# EAGLE design KEYWAVE STARTER (EAGLE 6.5.0)
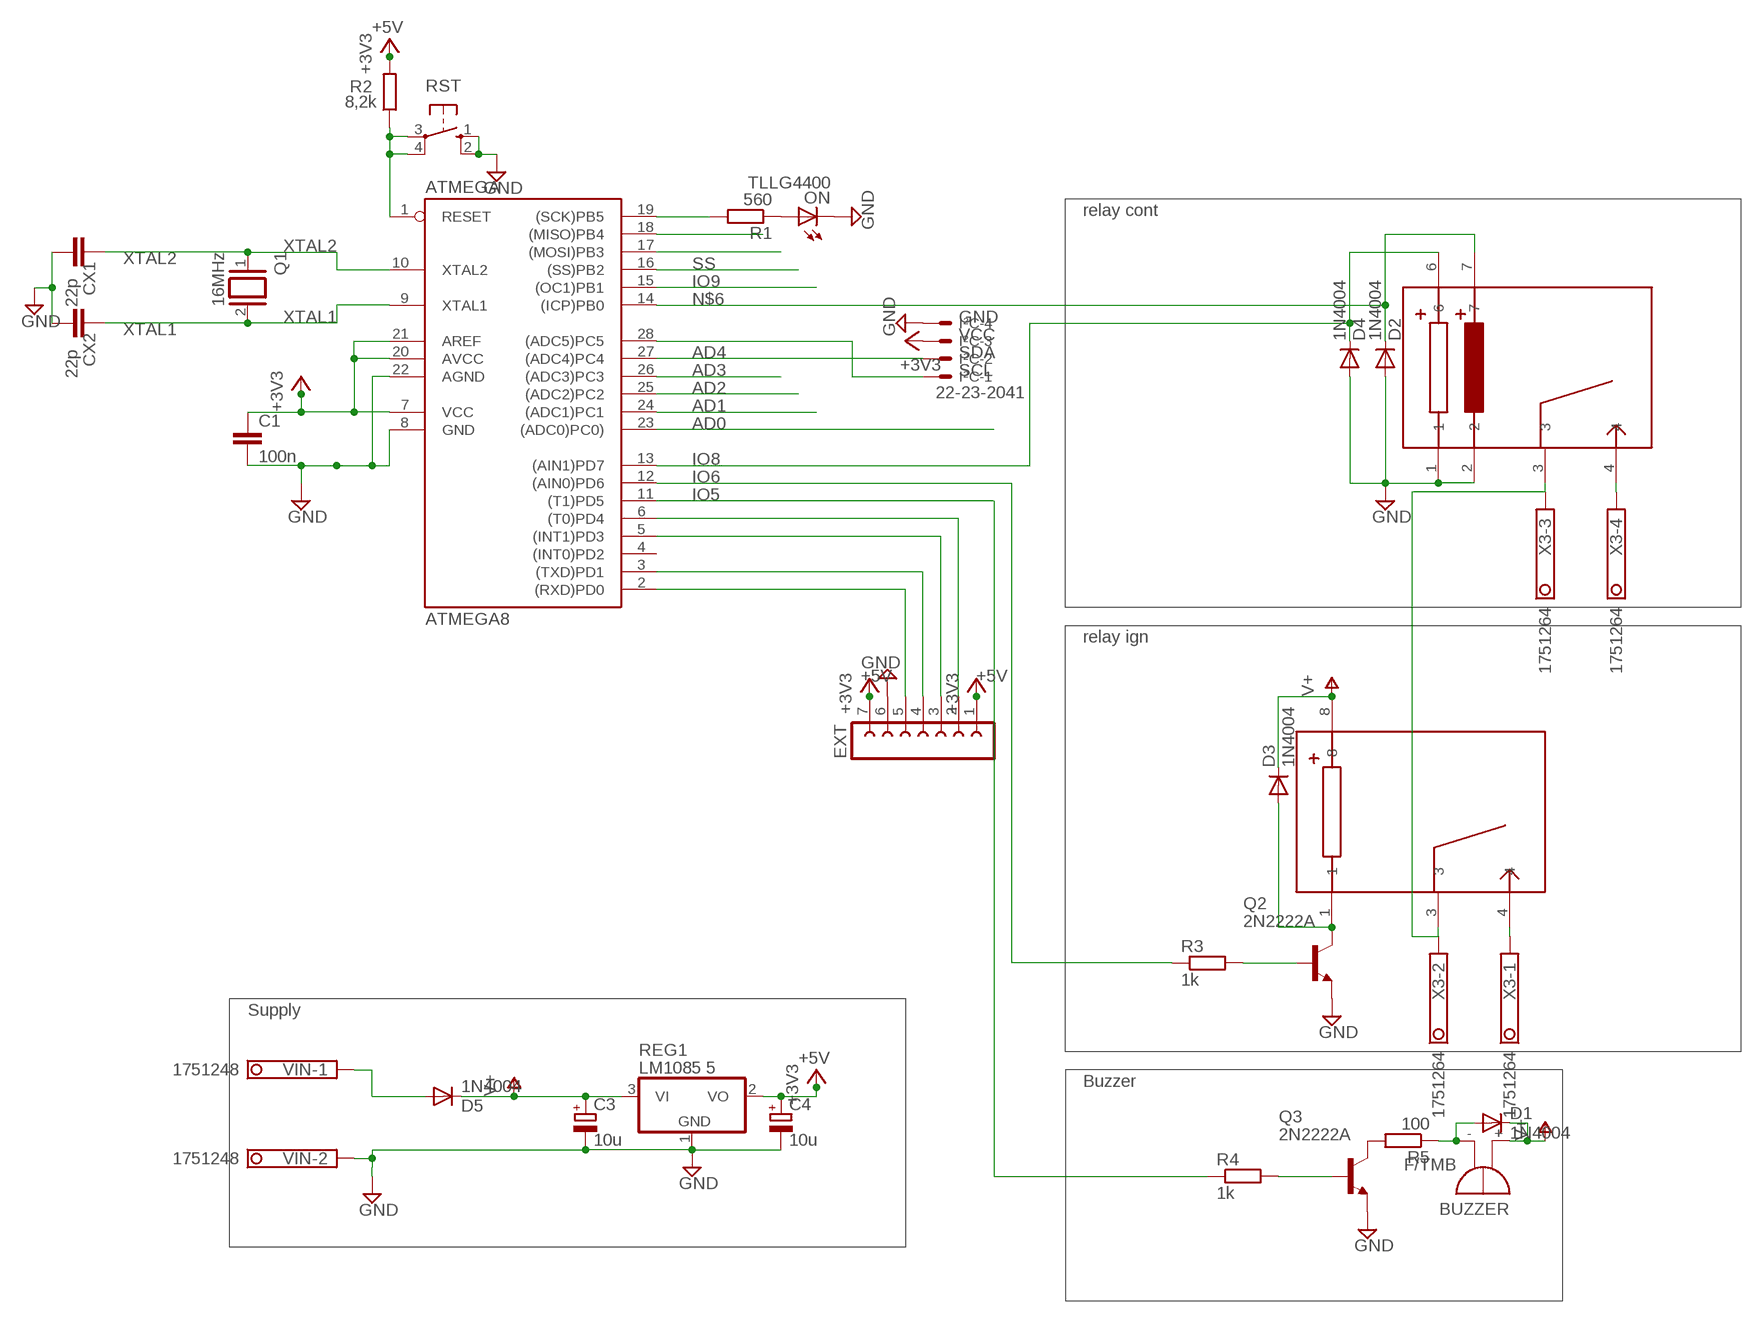
[diagram p0: schematic, sheet 1]

## Parts
ATMEGA  ATMEGA8  AT90S4433P  [DIL28-3]
BUZZER  F/TMB  [F/TMB]
C1  100n  C-EU050-030X075  [C050-030X075]
C3  10u  CPOL-EUE5-6  [E5-6]
C4  10u  CPOL-EUE5-6  [E5-6]
CONTACT  D6BK-1114P  [D6BK-1114C]
CX1  22p  C-EU0603-RND  [C0603-ROUND]
CX2  22p  C-EU0603-RND  [C0603-ROUND]
D1  1N4004  [DO41-10]
D2  1N4004  [DO41-10]
D3  1N4004  [DO41-10]
D4  1N4004  [DO41-10]
D5  1N4004  [DO41-10]
EXT  FE07-1  [FE07]
I²C  22-23-2041  [22-23-2041]
ON  TLLG4400  [LED3MM]
Q1  16MHz  XTAL/S  [QS]
Q2  2N2222A  [TO18]
Q3  2N2222A  [TO18]
R1  560  R-EU_0207/10  [0207/10]
R2  8,2k  R-EU_0207/10  [0207/10]
R3  1k  R-EU_0207/10  [0207/10]
R4  1k  R-EU_0207/10  [0207/10]
R5  100  R-EU_0207/10  [0207/10]
REG1  LM1085 5  LM1086CT-3.3  [TO220]
RST  10-XX  [B3F-10XX]
STARTER  DK1-L1-12V  [DK1-L1-12V]
VIN  1751248  [1751248]
X3  1751264  [1751264]

## Nets
+3V3: ATMEGA.7(VCC) ATMEGA.20(AVCC) ATMEGA.21(AREF) C1.1 C4.+ EXT.1 EXT.7 I²C.3 R2.2 REG1.2(VO) ; supply symbol labelled +5V
AD0: ATMEGA.23((ADC0)PC0))
AD1: ATMEGA.24((ADC1)PC1)
AD2: ATMEGA.25((ADC2)PC2)
AD3: ATMEGA.26((ADC3)PC3)
AD4: ATMEGA.27((ADC4)PC4) I²C.2
GND: ATMEGA.8(GND) ATMEGA.22(AGND) C1.2 C3.- C4.- CONTACT.1 CONTACT.2 CX1.1 CX2.1 D2.A D4.A EXT.6 I²C.4 ON.K(C) Q2.1(E) Q3.1(E) REG1.1(GND) RST.1(S) RST.2(S1) VIN.2
IO5: ATMEGA.11((T1)PD5) R4.1
IO6: ATMEGA.12((AIN0)PD6) R3.1
IO8: ATMEGA.13((AIN1)PD7) CONTACT.6 D4.C
IO9: ATMEGA.15((OC1)PB1)
MISO: ATMEGA.18((MISO)PB4)
MOSI: ATMEGA.17((MOSI)PB3)
N$1: STARTER.4 X3.1
N$2: Q3.3(C) R5.2
N$3: D5.A VIN.1
N$5: Q2.2(B) R3.2
N$6: ATMEGA.14((ICP)PB0) CONTACT.7 D2.C
N$8: CONTACT.3 STARTER.3 X3.2 X3.3
N$9: ATMEGA.28((ADC5)PC5) I²C.1
N$10: CONTACT.4 X3.4
N$11: ATMEGA.2((RXD)PD0) EXT.5
N$12: ATMEGA.3((TXD)PD1) EXT.4
N$13: ATMEGA.5((INT1)PD3) EXT.3
N$14: ATMEGA.6((T0)PD4) EXT.2
N$16: Q3.2(B) R4.2
N$17: D3.A Q2.3(C) STARTER.1
N$19: BUZZER.- D1.A R5.1
N$22: ON.A R1.1
RESET: ATMEGA.1(RESET) R2.1 RST.3(P) RST.4(P1)
SCK: ATMEGA.19((SCK)PB5) R1.2
SS: ATMEGA.16((SS)PB2)
V+: BUZZER.+ C3.+ D1.C D3.C D5.C REG1.3(VI) STARTER.8
XTAL1: ATMEGA.9(XTAL1) CX2.2 Q1.2
XTAL2: ATMEGA.10(XTAL2) CX1.2 Q1.1
Unconnected: ATMEGA.4((INT0)PD2)

## Notes on the sheet
- relay cont
- GND
- VCC
- SDA
- SCL
- relay ign
- Supply
- Buzzer

## Library data of the parts
ATMEGA = atmel:AT90S4433: MICROCONTROLLER 4 Kbytes FLASH 128 bytes SRAM 256 bytes EEPROM UART 6-channel 10 bit ADC
BUZZER = buzzer:F/TMB: BUZZER Source: Buerklin; OC_FARNELL: unknown; OC_NEWARK: unknown
C1 = rcl:C-EU: CAPACITOR, European symbol
C3 C4 = rcl:CPOL-EU: POLARIZED CAPACITOR, European symbol
CONTACT = stein:D6BK-1114P
CX1 CX2 = SmartPrj:C-EU: CAPACITOR, European symbol
D1-D5 = diode:1N4004: DIODE general purpose rectifier, 1 A
EXT = con-lsta:FE07-1: FEMALE HEADER; OC_FARNELL: unknown; OC_NEWARK: unknown
I²C = con-molex:22-23-2041: .100" (2.54mm) Center Header - 4 Pin; MF: MOLEX; MPN: 22-23-2041; OC_FARNELL: 1462920; OC_NEWARK: 38C0355
ON = led:TLLG4400: Low Current (2mA) LED 3 mm Tinted Diffused Package color GREEN Source: Data sheet <http://www.farnell.com/datasheets/391098.pdf>; MF: VISHAY SEMICONDUCTOR; OC_FARNELL: 1612435
Q1 = special:XTAL/S: CRYSTAL
Q2 Q3 = transistor-npn:2N2222*: NPN Transistor
R1-R5 = rcl:R-EU_: RESISTOR, European symbol
REG1 = natsemi:LM1086?-*: Positive VOLTAGE REGULATOR From National Semiconductors LM1086 datasheet <http://www.national.com/ds/LM/LM1086.pdf>
RST = switch-omron:10-XX: OMRON SWITCH; MPN: B3F-1000; OC_FARNELL: 176432; OC_NEWARK: 36M3542
STARTER = stein:DK1-L1-12V
VIN = con-phoenix-350:1751248: MKDS 1/ 2-3,5 Printklemme Nennstrom: 10 A Bemessungsspannung: 160 V Raster: 3,5 mm Polzahl: 2 Montageart: Löten Anschlussart: Schraubanschluss Anschlussrichtung vom Leiter zur Platine: 0° Source: http://eshop.phoenixcontact.com .. 1751248.pdf; OC_FARNELL: unknown; OC_NEWARK: unknown
X3 = con-phoenix-350:1751264: MKDS 1/ 4-3,5 Printklemme Nennstrom: 10 A Bemessungsspannung: 160 V Raster: 3,5 mm Polzahl: 4 Montageart: Löten Anschlussart: Schraubanschluss Anschlussrichtung vom Leiter zur Platine: 0° Source: http://eshop.phoenixcontact.com .. 1751264.pdf; MPN: 1751264; OC_FARNELL: unknown; OC_NEWARK: 10R0934

## Net classes
1 power: width 0.6 mm, clearance 0.305 mm

## Board
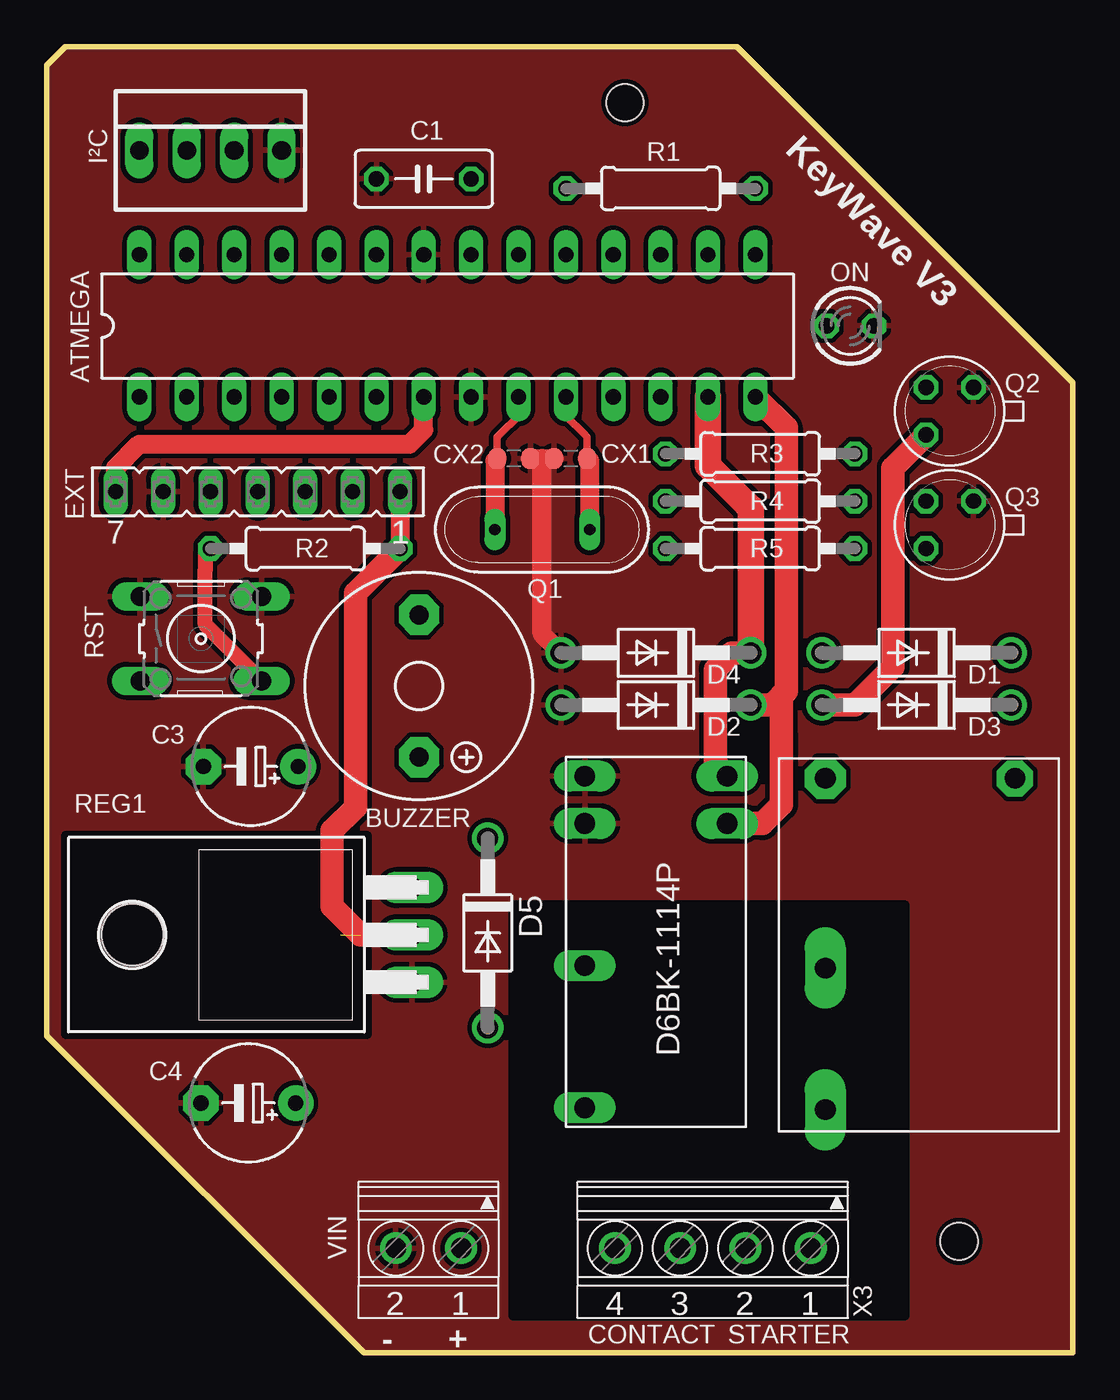
[diagram p1: board, top side]
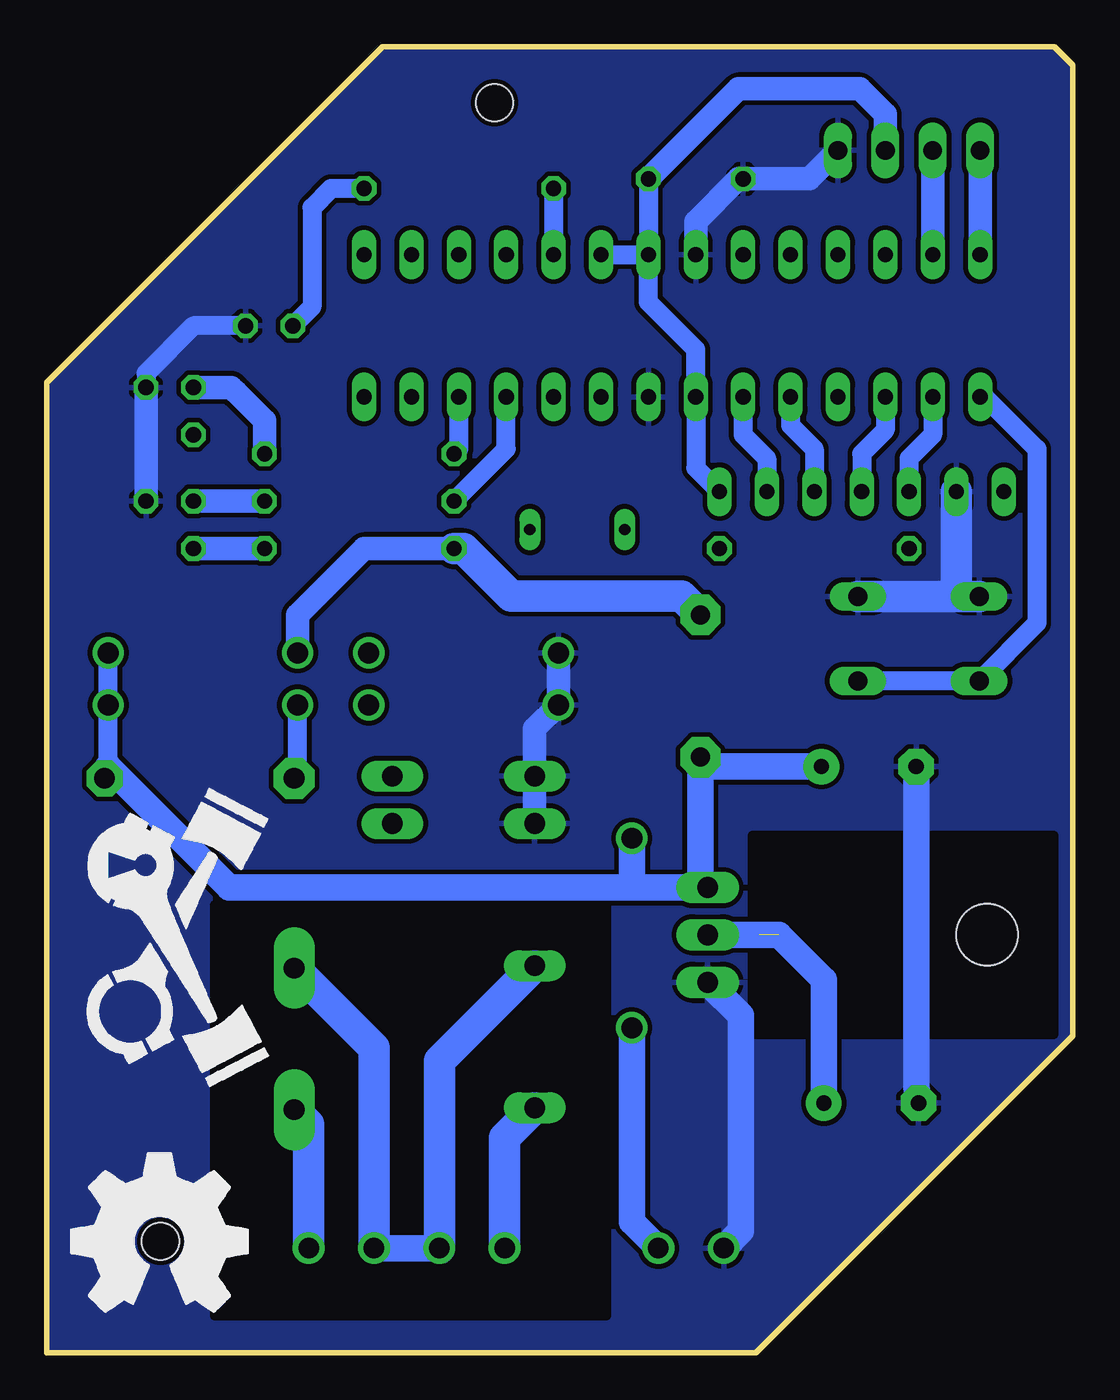
[diagram p2: board, bottom side, seen from below]

Size 55 x 70 mm. Coordinates in mm from the lower left corner, seen from the top.
Outline: 17,0 55,0 55,52 37,70 1,70 0,69 0,17 17,0
Copper layers (1*16): Top 0.035mm / dielectric 1.5mm / Bottom 0.035mm
Design rules "default": minimum track width 10mil, minimum drill 24mil, track to track 8mil, track to pad 8mil, pad to pad 8mil, via to via 8mil, smd to smd 8mil, copper to edge 0mil, drill to drill 8mil, minimum pad ring 10mil, minimum via ring 8mil, stop-mask expansion 4mil, vias tented up to drill 0mil, thermal gap 10mil
Holes 2 mm at 48.9,5.97 31,67
tRestrict: area 25,2 to 46,24
bRestrict: area 25,2 to 46,24

### Footprints (pad centres in the part's own frame; a part is rotated, then mirrored left to right if it is on the bottom)
DIL28-3 = drill 0.813 long: 1 -16.51,-3.81; 2 -13.97,-3.81; 3 -11.43,-3.81; 4 -8.89,-3.81; 5 -6.35,-3.81; 6 -3.81,-3.81; 7 -1.27,-3.81; 8 1.27,-3.81; 9 3.81,-3.81; 10 6.35,-3.81; 11 8.89,-3.81; 12 11.43,-3.81; 13 13.97,-3.81; 14 16.51,-3.81; 15 16.51,3.81; 16 13.97,3.81; 17 11.43,3.81; 18 8.89,3.81; 19 6.35,3.81; 20 3.81,3.81; 21 1.27,3.81; 22 -1.27,3.81; 23 -3.81,3.81; 24 -6.35,3.81; 25 -8.89,3.81; 26 -11.43,3.81; 27 -13.97,3.81; 28 -16.51,3.81
F/TMB = drill 1.016 pad 2.159 octagon: + 3.81,0; - -3.81,0
C050-030X075 = drill 0.813 octagon: 1 -2.54,0; 2 2.54,0
E5-6 = drill 0.813 pad 1.905: + -2.54,0 | drill 0.813 pad 1.905 octagon: - 2.54,0
D6BK-1114C = drill 1.1 long: 1 0,0; 2 2.54,0; 3 10.16,0; 4 17.78,0; 6 0,7.62; 7 2.54,7.62
C0603-ROUND = smd 0.898 x 1.1: 1 -0.889,0; 2 0.889,0
DO41-10 = drill 1.118: A 5.08,0; C -5.08,0
FE07 = drill 0.813 long: 1 -7.62,0; 2 -5.08,0; 3 -2.54,0; 4 0,0; 5 2.54,0; 6 5.08,0; 7 7.62,0
22-23-2041 = drill 1 long: 1 -3.81,0; 2 -1.27,0; 3 1.27,0; 4 3.81,0
LED3MM = drill 0.813 octagon: A -1.27,0; K 1.27,0
QS = drill 0.61 long: 1 -2.54,0; 2 2.54,0
TO18 = drill 0.813 octagon: 1 -1.27,-1.27; 2 1.27,-1.27; 3 1.27,1.27
0207/10 = drill 0.813 octagon: 1 -5.08,0; 2 5.08,0
TO220 = drill 1.118 long: 1 -2.54,-6.35; 2 0,-6.35; 3 2.54,-6.35 | hole 3.302: 0,8.636
B3F-10XX = drill 1.016 long: 1 -3.251,2.261; 2 3.251,2.261; 3 -3.251,-2.261; 4 3.251,-2.261
DK1-L1-12V = drill 1.1 pad 2.184 octagon: 1 7.495,3.62 | drill 1.1 pad 2.184 long: 3 -2.665,3.62; 4 -10.265,3.62 | drill 1.1 pad 1.93 octagon: 8 7.495,-6.54
1751248 = drill 1.1 pad 1.7: 1 -1.75,-0.1; 2 1.75,-0.1
1751264 = drill 1.1 pad 1.7: 1 -5.25,-0.1; 2 -1.75,-0.1; 3 1.75,-0.1; 4 5.25,-0.1

### Placement (x,y rotation side)
ATMEGA  21.48,55.04 0 top
BUZZER  19.96,35.74 270 top
C1  20.21,62.91 180 top
C3  10.94,31.42 180 top
C4  10.81,13.38 180 top
CONTACT  28.85,30.91 270 top
CX1  28.08,47.93 0 top
CX2  25.04,47.93 180 top
D1  46.63,37.51 180 top
D2  32.66,34.72 180 top
D3  46.63,34.72 180 top
D4  32.66,37.51 180 top
D5  23.64,22.5 270 top
EXT  11.32,46.15 180 top
I²C  8.78,64.44 0 top
ON  43.07,55.04 0 top
Q1  26.56,44.12 180 top
Q2  48.4,50.47 180 top
Q3  48.4,44.37 180 top
R1  32.91,62.4 180 top
R2  13.86,43.1 0 top
R3  38.24,48.18 0 top
R4  38.24,45.64 0 top
R5  38.24,43.1 0 top
REG1  13.23,22.4 90 top
RST  8.27,38.28 0 top
STARTER  45.36,23.29 90 top
VIN  20.46,5.51 180 top
X3  35.7,5.51 180 top

### Tracks (layer width: path | path; a pad name or v marks a point on that pad's centre or on a via)
+3V3  (1 unrouted)
  Top 1.016: EXT.7 3.7,47.42 4.97,48.69 19.45,48.69 20.21,49.45 ATMEGA.7 | EXT.1 R2.2
  Top 1.27: 16.83,22.4 15.31,23.92 15.31,27.99 16.55,29.23 16.55,40.71 R2.2
  Bottom 1.016: ATMEGA.21 22.75,56.31 20.21,53.77 ATMEGA.7 20.21,47.42 EXT.1 | ATMEGA.20 ATMEGA.21 | C1.1 ATMEGA.21
  Bottom 1.27: I²C.3 10.05,66.37 11.42,67.74 17.92,67.74 C1.1
  Bottom 1.422: C4.+ 13.35,19.99 15.77,22.4 REG1.2
AD4
  Bottom 1.27: I²C.2 ATMEGA.27
GND
  Top 1.016: D4.A 26.56,38.53 26.56,47.93 | 26.56,47.93 CX1.1 | CX2.1 26.56,47.93
  Bottom 1.016: ON.K 47.13,55.04 49.67,52.5 Q2.1
  Bottom 1.27: Q2.1 Q3.1 | CONTACT.2 CONTACT.1 28.85,33.45 D2.A D4.A | I²C.4 14.11,62.91 C1.2 17.92,62.91 20.21,60.63 ATMEGA.22
  Bottom 1.422: VIN.2 17.8,6.53 17.8,18.08 REG1.1 | C4.- 8.4,14.27 C3.-
  Bottom 1.676: RST.1 6.24,40.54 | 6.24,40.54 RST.2 | EXT.6 6.24,40.54
  pour Bottom (isolate 0.254): 0,69 1,70 37,70 55,52 55,0 17,0 0,17
  pour Top (isolate 0.254): 0,69 1,70 37,70 55,52 55,0 17,0 0,17
IO5
  Bottom 1.016: R4.1 30.37,48.44 ATMEGA.11
IO6
  Bottom 1.016: R3.1 32.91,48.44 ATMEGA.12
IO8
  Top 1.27: D4.C 36.72,37.51 35.83,36.62 35.83,31.55 CONTACT.6
  Top 1.422: ATMEGA.13 35.45,47.55 37.5,45.5 37.74,45.26 D4.C
N$1
  Bottom 1.676: STARTER.4 40.95,12.24 X3.1
N$2
  Bottom 1.27: R5.2 Q3.3
N$3
  Bottom 1.422: D5.A 23.64,7.04 VIN.1
N$5
  Bottom 1.27: R3.2 43.32,49.96 44.85,51.48 45.1,51.74 Q2.2
N$6
  Top 1.27: ATMEGA.14 39.64,49.58 39.64,36.37 39.64,35.48 39.32,35.16 | CONTACT.7 38.37,28.37 39.39,29.39 39.39,30.27 39.39,33.07 39.39,35.1 39.32,35.16 | D2.C 38.88,34.72 39.32,35.16
N$8
  Bottom 1.422: X3.2 X3.3
  Bottom 1.676: CONTACT.3 33.95,15.64 X3.3 | STARTER.3 37.45,16.34 X3.2
N$9
  Bottom 1.27: I²C.1 ATMEGA.28
N$10
  Bottom 1.676: CONTACT.4 30.45,11.52 X3.4
N$11
  Bottom 1.016: ATMEGA.2 7.51,49.2 8.78,47.93 EXT.5
N$12
  Bottom 1.016: ATMEGA.3 10.05,49.45 11.07,48.44 11.32,48.18 EXT.4
N$13
  Bottom 1.016: ATMEGA.5 15.13,49.71 13.86,48.44 EXT.3
N$14
  Bottom 1.016: ATMEGA.6 17.67,49.2 16.4,47.93 EXT.2
N$16
  Bottom 1.27: R4.2 Q3.2
N$17
  Top 1.27: Q2.3 45.36,47.42 45.36,39.55 45.36,36.75 43.32,34.72 D3.A
  Bottom 1.016: STARTER.1 41.55,30.98 D3.A
N$19
  Bottom 1.27: R5.1 37.99,43.1 41.55,39.55 D1.A
  Bottom 1.676: BUZZER.- 20.97,40.56 30.12,40.56 32.66,43.1 R5.1
N$22
  Bottom 1.016: R1.1 39.77,62.4 40.78,61.38 40.78,56.06 ON.A
RESET
  Top 0.813: RST.4 8.5,39.04 8.5,42 8.5,42.82 R2.1
  Bottom 1.016: ATMEGA.1 4.72,51.23 1.92,48.44 1.92,39.11 RST.3 RST.4
SCK
  Bottom 1.016: R1.2 ATMEGA.19
V+
  Bottom 1.016: D1.C D3.C 51.71,31.42 51.71,30.98 STARTER.8
  Bottom 1.422: 19.7,24.81 REG1.3 19.96,25.32 | C3.+ 19.45,31.42 BUZZER.+ 19.96,25.32 | 51.71,31.42 45.23,24.94 23.41,24.94 | 23.41,24.94 20.34,24.94 19.96,25.32 | D5.C 23.64,25.17 23.41,24.94
XTAL1
  Top 0.406: ATMEGA.9 25.29,50.21 24.27,49.2 24.15,49.07 CX2.2
  Top 1.016: CX2.2 24.02,47.8 Q1.2
XTAL2
  Top 0.406: ATMEGA.10 27.83,50.21 28.85,49.2 28.97,49.07 CX1.2
  Top 1.016: CX1.2 29.1,47.8 Q1.1

### Text on the board
tPlace: KeyWave V3 | CONTACT | STARTER | - | +